# Altium schematic sheet SPI.SCHDOC
size A4; SheetNumber: 6
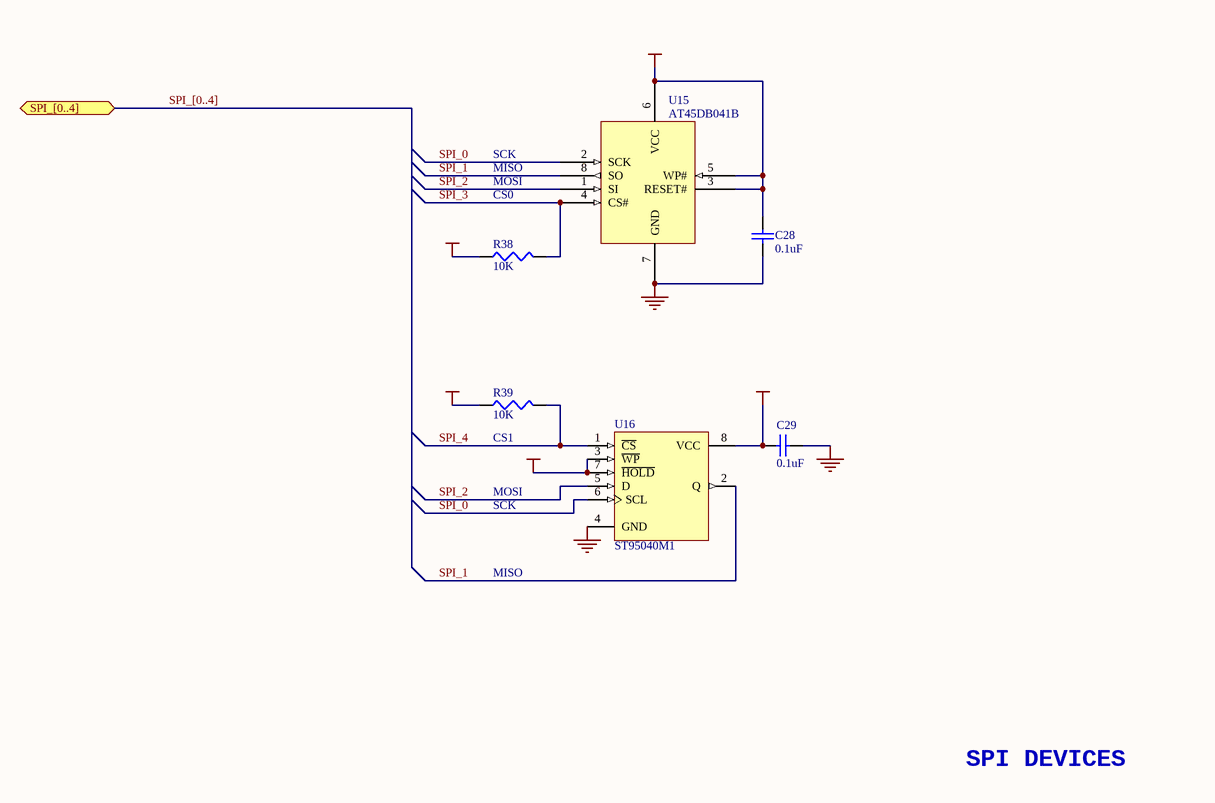
[diagram p0: SPI.SCHDOC]

## Parts
C28  value 0.1uF  [_0805]  (hidden comment: Cap Semi)
C29  value 0.1uF  [_0805]  (hidden comment: Cap Semi)
R38  value 10K  [_0805]  (hidden comment: Res3)
R39  value 10K  [_0805]  (hidden comment: Res3)
U15  AT45DB041B  [SO-G8/E4.1]
U16  ST95040M1  [SOP8]

## Ports
SPI_[0..4] (bidir)

## Nets
GND: C28.2 C29.2 U15.7(GND) U16.4(GND)
VCC_3V: C28.1 C29.1 R38.1 R39.1 U15.3(RESET#) U15.5(WP#) U15.6(VCC) U16.3(~{WP}) U16.7(~{HOLD}) U16.8(VCC)
SPI_0: U15.2(SCK) U16.6(SCL)
SPI_1: U15.8(SO) U16.2(Q)
SPI_2: U15.1(SI) U16.5(D)
SPI_3: R38.2 U15.4(CS#)
SPI_4: R39.2 U16.1(~{CS})

## Buses and harness runs
bus SPI_[0..4] = port SPI_[0..4]

## Notes on the sheet
- SCK
- MISO
- MOSI
- CS0
- (near R39) CS1
- SPI DEVICES

## Library data of the parts
C28 C29 = Cap Semi: Capacitor (Semiconductor SIM Model); Published: 8-Jun-2000; Revision: July-2002: Re-released for DXP Platform.; Publisher: Altium Limited
R38 R39 = Res3: Resistor; Published: 8-Jun-2000; Revision: July-2002: Re-released for DXP Platform.; Publisher: Altium Limited
U15 = AT45DB041B: 4 Megabit DataFlash Memory
U16 = ST95040M1: 4K Serial SPI EEPROM with Positive Clock Strobe; Package Information: Latest Revision: Jul-1999; Published: 24-Aug-2001; Revision: 17-Jul-2002: Re-released for DXP Platform.; Datasheet: Latest Revision: Jun-1998; Package Reference: SOP8; Publisher: Altium Limited